# Altium schematic sheet TSK3000A_MOD_Player_Xilinx.SchDoc
size C; DocumentNumber: 1; SheetNumber: 1; SheetTotal: 4
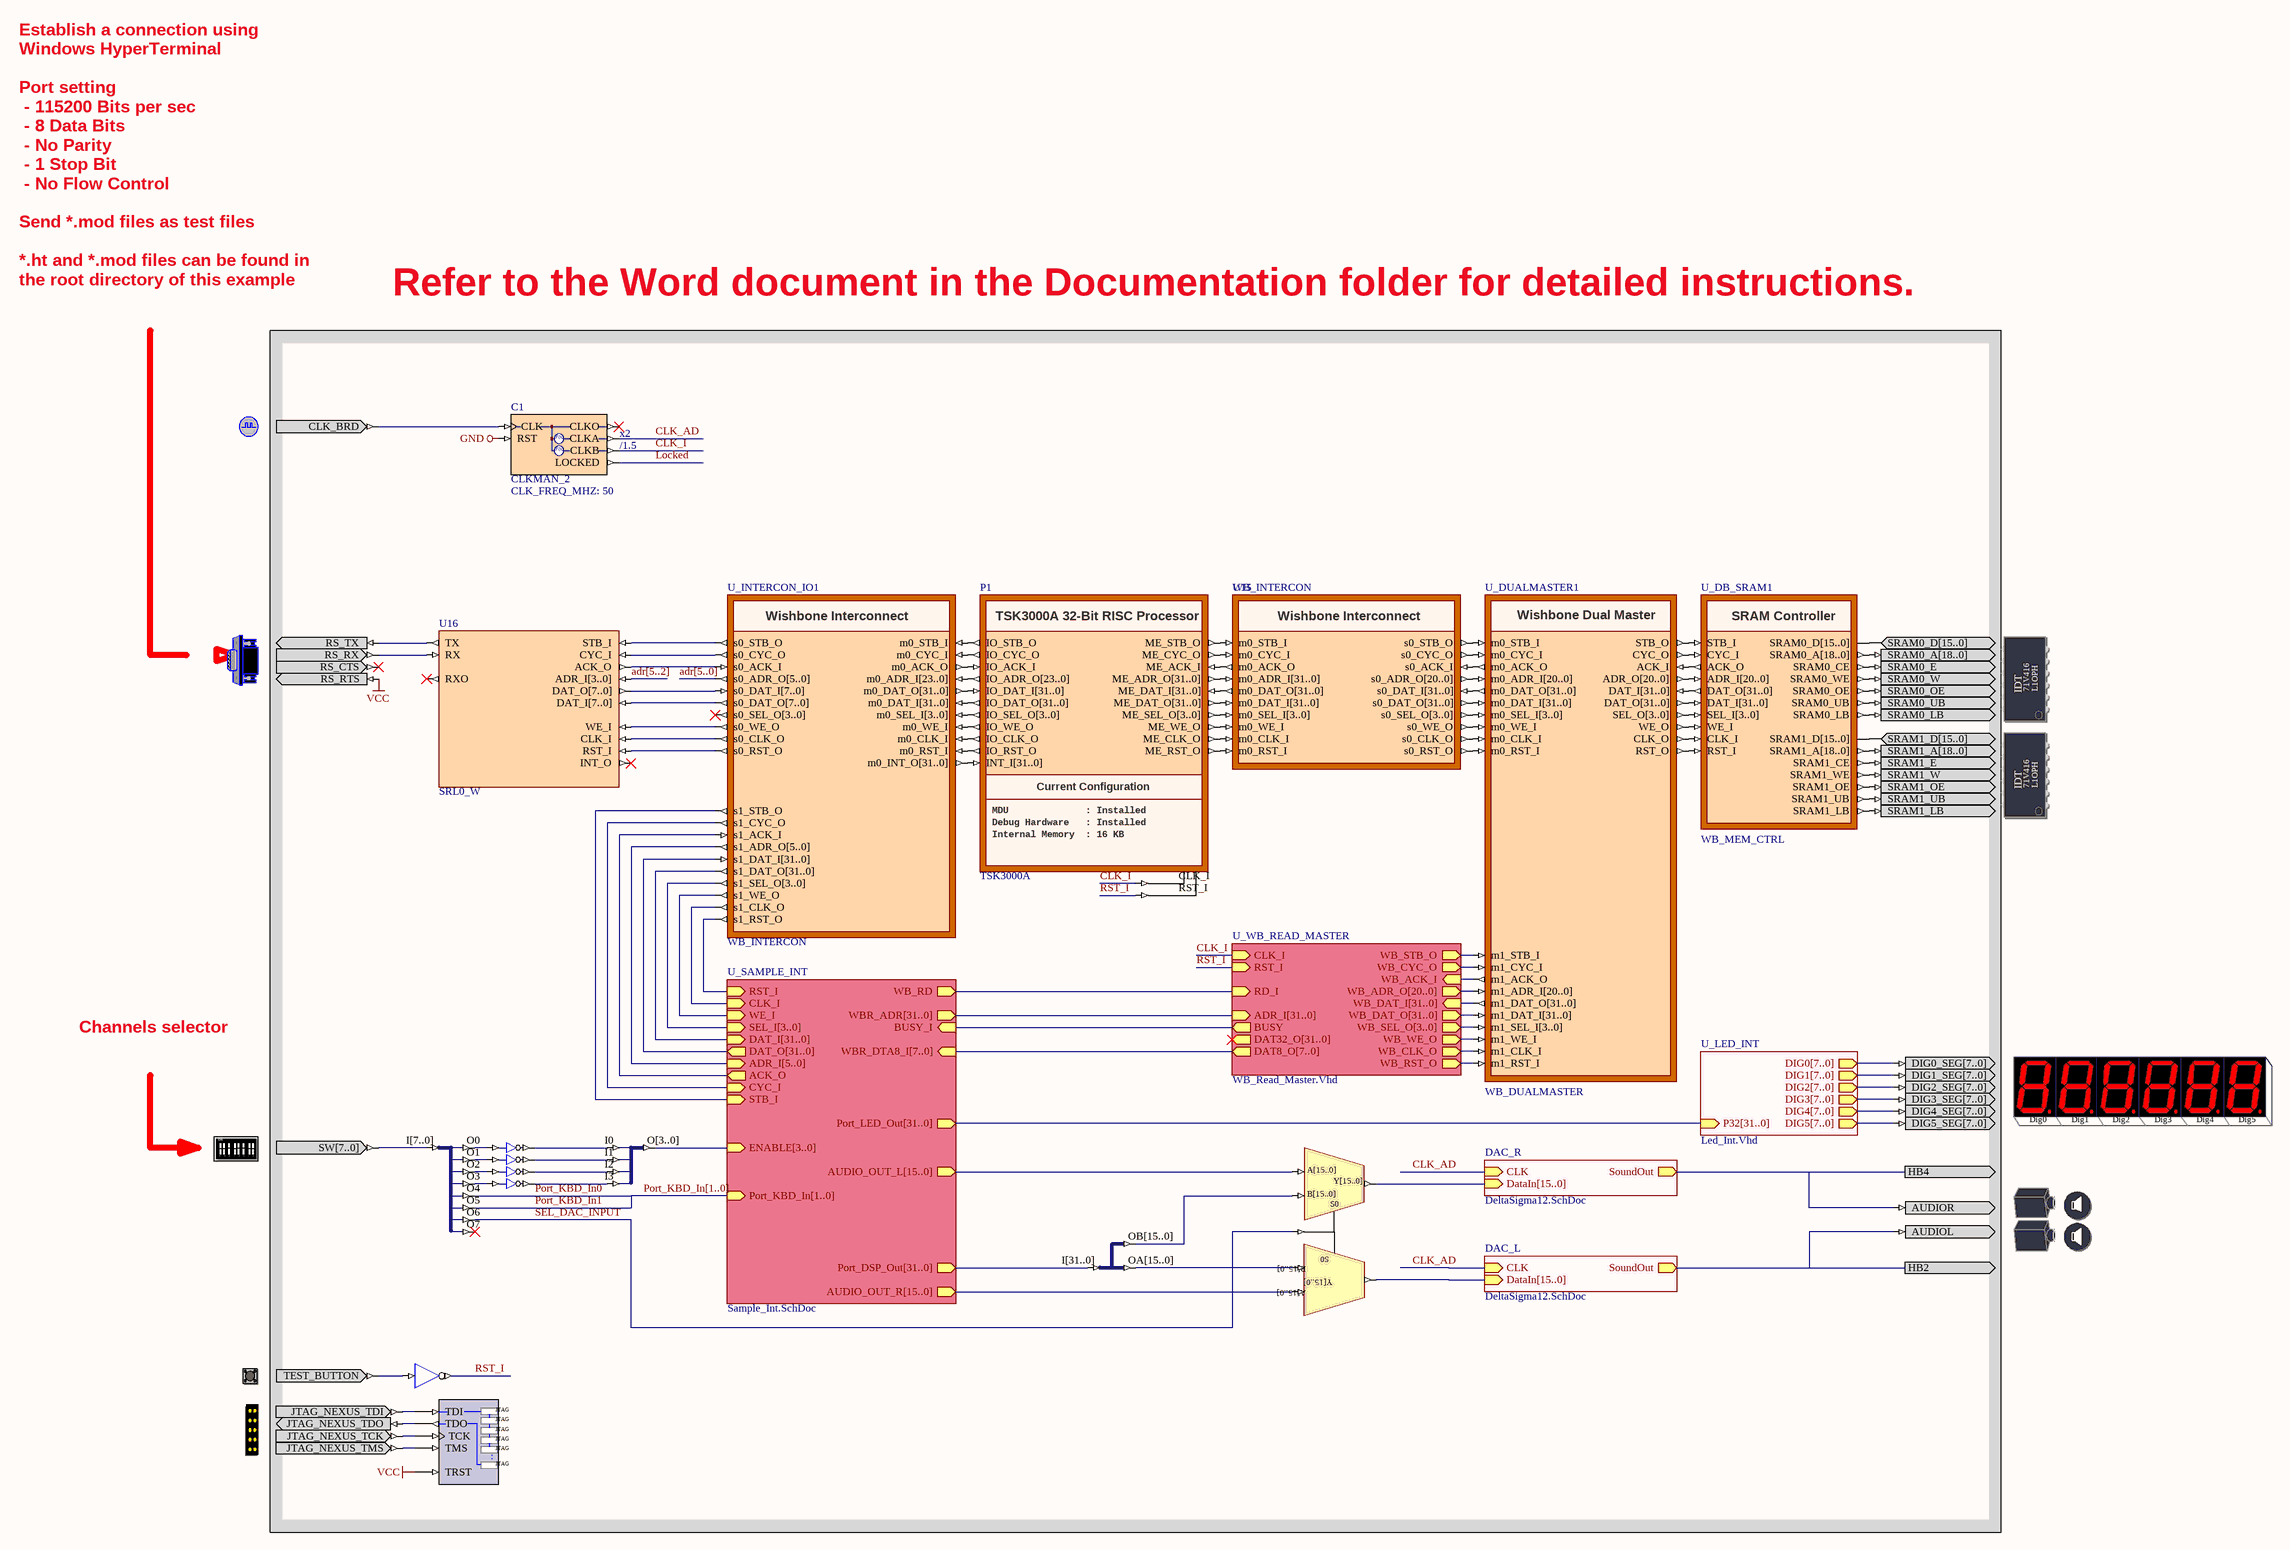
[diagram p0: TSK3000A_MOD_Player_Xilinx.SchDoc]

## Parts
(Parts that share a designator on the sheet are numbered #1, #2 ... from top to bottom, then left to right.)
?#1  CLOCK_BOARD  (value not drawn)
?#2  SRAM_DAUGHTER0  (value not drawn)
?#3  RS232CNTR  (value not drawn)
?#4  SRAM_DAUGHTER1  (value not drawn)
?#5  7SEGX6  (value not drawn)
?#6  DIPSWITCH  (value not drawn)
?#7  STEREO  (value not drawn)
?#8  TEST_BUTTON  (value not drawn)
?#9  NEXUS_JTAG_CONNECTOR  (value not drawn)
C1  CLKMAN_2  CLK_FREQ_MHZ: 50  ClkA_Operation: x2  ClkB_Operation: /1.5
NEXUS_JTAG_PORT  NEXUS_JTAG_PORT  (value not drawn)
P1  TSK3000A
U15  WB_INTERCON
U16  SRL0_W
U17  J8B_8S  (value not drawn)
U18  INV4S  (value not drawn)
U19  J4S_4B  (value not drawn)
U20  M16_B2B1  (value not drawn)
U21  J32B_16B2  (value not drawn)
U22  M16_B2B1  (value not drawn)
U23  INV  (value not drawn)
U_DB_SRAM1  WB_MEM_CTRL
U_DUALMASTER1  WB_DUALMASTER
U_INTERCON_IO1  WB_INTERCON

## Sub-sheets
DAC_L = DeltaSigma12.SchDoc: CLK (in), DataIn[15..0] (in), SoundOut (out)
DAC_R = DeltaSigma12.SchDoc: CLK (in), DataIn[15..0] (in), SoundOut (out)
U_LED_INT = Led_Int.Vhd: DIG0[7..0] (out), DIG1[7..0] (out), DIG2[7..0] (out), DIG3[7..0] (out), DIG4[7..0] (out), DIG5[7..0] (out), P32[31..0] (in)
U_SAMPLE_INT = Sample_Int.SchDoc: CYC_I (in), ACK_O (out), RST_I (in), STB_I (in), ADR_I[5..0] (in), DAT_O[31..0] (out), DAT_I[31..0] (in), SEL_I[3..0] (in), CLK_I (in), WE_I (in), WB_RD (out), WBR_ADR[31..0] (out), AUDIO_OUT_L[15..0] (out), WBR_DTA8_I[7..0] (in), AUDIO_OUT_R[15..0] (out), ENABLE[3..0] (in), BUSY_I (in), Port_KBD_In[1..0] (in), Port_DSP_Out[31..0] (out), Port_LED_Out[31..0] (out)
U_WB_READ_MASTER = WB_Read_Master.Vhd: WB_STB_O (out), WB_CYC_O (out), WB_ACK_I (in), WB_ADR_O[20..0] (out), WB_DAT_I[31..0] (in), WB_DAT_O[31..0] (out), WB_SEL_O[3..0] (out), WB_WE_O (out), WB_CLK_O (out), WB_RST_O (out), CLK_I (in), RST_I (in), RD_I (in), ADR_I[31..0] (in), DAT32_O[31..0] (out), BUSY (out), DAT8_O[7..0] (out)

## Ports
HB2 (out), HB4 (out)

## Nets
GND: C1.RST
VCC: ?#3.RS_RTS NEXUS_JTAG_PORT.TRST
adr[5..0]: U_INTERCON_IO1.s0_ADR_O[5..0]
adr[5..2]: U16.ADR_I[3..0]
CLK_AD: C1.CLKA ; sheet DAC_L/CLK, sheet DAC_R/CLK
CLK_I: C1.CLKB P1.CLK_I ; sheet U_WB_READ_MASTER/CLK_I
HB2: ?#7.AUDIOL ; port HB2, sheet DAC_L/SoundOut
HB4: ?#7.AUDIOR ; port HB4, sheet DAC_R/SoundOut
Locked: C1.LOCKED
Port_KBD_In0: U17.O4
Port_KBD_In1: U17.O5
RST_I: P1.RST_I U23.O ; sheet U_WB_READ_MASTER/RST_I
SEL_DAC_INPUT: U17.O6 U20.S0 U22.S0
Net?#1_CLK_BRD: ?#1.CLK_BRD C1.CLK
Net?#2_SRAM0_A[18..0]: ?#2.SRAM0_A[18..0] U_DB_SRAM1.SRAM0_A[18..0]
Net?#2_SRAM0_D[15..0]: ?#2.SRAM0_D[15..0] U_DB_SRAM1.SRAM0_D[15..0]
Net?#2_SRAM0_E: ?#2.SRAM0_E U_DB_SRAM1.SRAM0_CE
Net?#2_SRAM0_LB: ?#2.SRAM0_LB U_DB_SRAM1.SRAM0_LB
Net?#2_SRAM0_OE: ?#2.SRAM0_OE U_DB_SRAM1.SRAM0_OE
Net?#2_SRAM0_UB: ?#2.SRAM0_UB U_DB_SRAM1.SRAM0_UB
Net?#2_SRAM0_W: ?#2.SRAM0_W U_DB_SRAM1.SRAM0_WE
Net?#3_RS_RX: ?#3.RS_RX U16.RX
Net?#3_RS_TX: ?#3.RS_TX U16.TX
Net?#4_SRAM1_A[18..0]: ?#4.SRAM1_A[18..0] U_DB_SRAM1.SRAM1_A[18..0]
Net?#4_SRAM1_D[15..0]: ?#4.SRAM1_D[15..0] U_DB_SRAM1.SRAM1_D[15..0]
Net?#4_SRAM1_E: ?#4.SRAM1_E U_DB_SRAM1.SRAM1_CE
Net?#4_SRAM1_LB: ?#4.SRAM1_LB U_DB_SRAM1.SRAM1_LB
Net?#4_SRAM1_OE: ?#4.SRAM1_OE U_DB_SRAM1.SRAM1_OE
Net?#4_SRAM1_UB: ?#4.SRAM1_UB U_DB_SRAM1.SRAM1_UB
Net?#4_SRAM1_W: ?#4.SRAM1_W U_DB_SRAM1.SRAM1_WE
Net?#5_DIG0_SEG[7..0]: ?#5.DIG0_SEG[7..0] ; sheet U_LED_INT/DIG0[7..0]
Net?#5_DIG1_SEG[7..0]: ?#5.DIG1_SEG[7..0] ; sheet U_LED_INT/DIG1[7..0]
Net?#5_DIG2_SEG[7..0]: ?#5.DIG2_SEG[7..0] ; sheet U_LED_INT/DIG2[7..0]
Net?#5_DIG3_SEG[7..0]: ?#5.DIG3_SEG[7..0] ; sheet U_LED_INT/DIG3[7..0]
Net?#5_DIG4_SEG[7..0]: ?#5.DIG4_SEG[7..0] ; sheet U_LED_INT/DIG4[7..0]
Net?#5_DIG5_SEG[7..0]: ?#5.DIG5_SEG[7..0] ; sheet U_LED_INT/DIG5[7..0]
Net?#6_SW[7..0]: ?#6.SW[7..0] U17.I[7..0]
Net?#8_TEST_BUTTON: ?#8.TEST_BUTTON U23.I
Net?#9_JTAG_NEXUS_TCK: ?#9.JTAG_NEXUS_TCK NEXUS_JTAG_PORT.TCK
Net?#9_JTAG_NEXUS_TDI: ?#9.JTAG_NEXUS_TDI NEXUS_JTAG_PORT.TDI
Net?#9_JTAG_NEXUS_TDO: ?#9.JTAG_NEXUS_TDO NEXUS_JTAG_PORT.TDO
Net?#9_JTAG_NEXUS_TMS: ?#9.JTAG_NEXUS_TMS NEXUS_JTAG_PORT.TMS
NetP1_INT_I[31..0]: P1.INT_I[31..0] U_INTERCON_IO1.m0_INT_O[31..0]
NetP1_IO_ACK_I: P1.IO_ACK_I U_INTERCON_IO1.m0_ACK_O
NetP1_IO_ADR_O[23..0]: P1.IO_ADR_O[23..0] U_INTERCON_IO1.m0_ADR_I[23..0]
NetP1_IO_CLK_O: P1.IO_CLK_O U_INTERCON_IO1.m0_CLK_I
NetP1_IO_CYC_O: P1.IO_CYC_O U_INTERCON_IO1.m0_CYC_I
NetP1_IO_DAT_I[31..0]: P1.IO_DAT_I[31..0] U_INTERCON_IO1.m0_DAT_O[31..0]
NetP1_IO_DAT_O[31..0]: P1.IO_DAT_O[31..0] U_INTERCON_IO1.m0_DAT_I[31..0]
NetP1_IO_RST_O: P1.IO_RST_O U_INTERCON_IO1.m0_RST_I
NetP1_IO_SEL_O[3..0]: P1.IO_SEL_O[3..0] U_INTERCON_IO1.m0_SEL_I[3..0]
NetP1_IO_STB_O: P1.IO_STB_O U_INTERCON_IO1.m0_STB_I
NetP1_IO_WE_O: P1.IO_WE_O U_INTERCON_IO1.m0_WE_I
NetP1_ME_ACK_I: P1.ME_ACK_I U15.m0_ACK_O
NetP1_ME_ADR_O[31..0]: P1.ME_ADR_O[31..0] U15.m0_ADR_I[31..0]
NetP1_ME_CLK_O: P1.ME_CLK_O U15.m0_CLK_I
NetP1_ME_CYC_O: P1.ME_CYC_O U15.m0_CYC_I
NetP1_ME_DAT_I[31..0]: P1.ME_DAT_I[31..0] U15.m0_DAT_O[31..0]
NetP1_ME_DAT_O[31..0]: P1.ME_DAT_O[31..0] U15.m0_DAT_I[31..0]
NetP1_ME_RST_O: P1.ME_RST_O U15.m0_RST_I
NetP1_ME_SEL_O[3..0]: P1.ME_SEL_O[3..0] U15.m0_SEL_I[3..0]
NetP1_ME_STB_O: P1.ME_STB_O U15.m0_STB_I
NetP1_ME_WE_O: P1.ME_WE_O U15.m0_WE_I
NetU15_s0_ACK_I: U15.s0_ACK_I U_DUALMASTER1.m0_ACK_O
NetU15_s0_ADR_O[20..0]: U15.s0_ADR_O[20..0] U_DUALMASTER1.m0_ADR_I[20..0]
NetU15_s0_CLK_O: U15.s0_CLK_O U_DUALMASTER1.m0_CLK_I
NetU15_s0_CYC_O: U15.s0_CYC_O U_DUALMASTER1.m0_CYC_I
NetU15_s0_DAT_I[31..0]: U15.s0_DAT_I[31..0] U_DUALMASTER1.m0_DAT_O[31..0]
NetU15_s0_DAT_O[31..0]: U15.s0_DAT_O[31..0] U_DUALMASTER1.m0_DAT_I[31..0]
NetU15_s0_RST_O: U15.s0_RST_O U_DUALMASTER1.m0_RST_I
NetU15_s0_SEL_O[3..0]: U15.s0_SEL_O[3..0] U_DUALMASTER1.m0_SEL_I[3..0]
NetU15_s0_STB_O: U15.s0_STB_O U_DUALMASTER1.m0_STB_I
NetU15_s0_WE_O: U15.s0_WE_O U_DUALMASTER1.m0_WE_I
NetU16_ACK_O: U16.ACK_O U_INTERCON_IO1.s0_ACK_I
NetU16_CLK_I: U16.CLK_I U_INTERCON_IO1.s0_CLK_O
NetU16_CYC_I: U16.CYC_I U_INTERCON_IO1.s0_CYC_O
NetU16_DAT_I[7..0]: U16.DAT_I[7..0] U_INTERCON_IO1.s0_DAT_O[7..0]
NetU16_DAT_O[7..0]: U16.DAT_O[7..0] U_INTERCON_IO1.s0_DAT_I[7..0]
NetU16_RST_I: U16.RST_I U_INTERCON_IO1.s0_RST_O
NetU16_STB_I: U16.STB_I U_INTERCON_IO1.s0_STB_O
NetU16_WE_I: U16.WE_I U_INTERCON_IO1.s0_WE_O
NetU17_O0: U17.O0 U18.I0
NetU17_O1: U17.O1 U18.I1
NetU17_O2: U17.O2 U18.I2
NetU17_O3: U17.O3 U18.I3
NetU18_O0: U18.O0 U19.I0
NetU18_O1: U18.O1 U19.I1
NetU18_O2: U18.O2 U19.I2
NetU18_O3: U18.O3 U19.I3
NetU19_O[3..0]: U19.O[3..0] ; sheet U_SAMPLE_INT/ENABLE[3..0]
NetU20_A[15..0]: U20.A[15..0] ; sheet U_SAMPLE_INT/AUDIO_OUT_L[15..0]
NetU20_B[15..0]: U20.B[15..0] U21.OB[15..0]
NetU20_Y[15..0]: U20.Y[15..0] ; sheet DAC_R/DataIn[15..0]
NetU21_I[31..0]: U21.I[31..0] ; sheet U_SAMPLE_INT/Port_DSP_Out[31..0]
NetU21_OA[15..0]: U21.OA[15..0] U22.B[15..0]
NetU22_A[15..0]: U22.A[15..0] ; sheet U_SAMPLE_INT/AUDIO_OUT_R[15..0]
NetU22_Y[15..0]: U22.Y[15..0] ; sheet DAC_L/DataIn[15..0]
NetU_DB_SRAM1_ACK_O: U_DB_SRAM1.ACK_O U_DUALMASTER1.ACK_I
NetU_DB_SRAM1_ADR_I[20..0]: U_DB_SRAM1.ADR_I[20..0] U_DUALMASTER1.ADR_O[20..0]
NetU_DB_SRAM1_CLK_I: U_DB_SRAM1.CLK_I U_DUALMASTER1.CLK_O
NetU_DB_SRAM1_CYC_I: U_DB_SRAM1.CYC_I U_DUALMASTER1.CYC_O
NetU_DB_SRAM1_DAT_I[31..0]: U_DB_SRAM1.DAT_I[31..0] U_DUALMASTER1.DAT_O[31..0]
NetU_DB_SRAM1_DAT_O[31..0]: U_DB_SRAM1.DAT_O[31..0] U_DUALMASTER1.DAT_I[31..0]
NetU_DB_SRAM1_RST_I: U_DB_SRAM1.RST_I U_DUALMASTER1.RST_O
NetU_DB_SRAM1_SEL_I[3..0]: U_DB_SRAM1.SEL_I[3..0] U_DUALMASTER1.SEL_O[3..0]
NetU_DB_SRAM1_STB_I: U_DB_SRAM1.STB_I U_DUALMASTER1.STB_O
NetU_DB_SRAM1_WE_I: U_DB_SRAM1.WE_I U_DUALMASTER1.WE_O
NetU_DUALMASTER1_m1_ACK_O: U_DUALMASTER1.m1_ACK_O ; sheet U_WB_READ_MASTER/WB_ACK_I
NetU_DUALMASTER1_m1_ADR_I[20..0]: U_DUALMASTER1.m1_ADR_I[20..0] ; sheet U_WB_READ_MASTER/WB_ADR_O[20..0]
NetU_DUALMASTER1_m1_CLK_I: U_DUALMASTER1.m1_CLK_I ; sheet U_WB_READ_MASTER/WB_CLK_O
NetU_DUALMASTER1_m1_CYC_I: U_DUALMASTER1.m1_CYC_I ; sheet U_WB_READ_MASTER/WB_CYC_O
NetU_DUALMASTER1_m1_DAT_I[31..0]: U_DUALMASTER1.m1_DAT_I[31..0] ; sheet U_WB_READ_MASTER/WB_DAT_O[31..0]
NetU_DUALMASTER1_m1_DAT_O[31..0]: U_DUALMASTER1.m1_DAT_O[31..0] ; sheet U_WB_READ_MASTER/WB_DAT_I[31..0]
NetU_DUALMASTER1_m1_RST_I: U_DUALMASTER1.m1_RST_I ; sheet U_WB_READ_MASTER/WB_RST_O
NetU_DUALMASTER1_m1_SEL_I[3..0]: U_DUALMASTER1.m1_SEL_I[3..0] ; sheet U_WB_READ_MASTER/WB_SEL_O[3..0]
NetU_DUALMASTER1_m1_STB_I: U_DUALMASTER1.m1_STB_I ; sheet U_WB_READ_MASTER/WB_STB_O
NetU_DUALMASTER1_m1_WE_I: U_DUALMASTER1.m1_WE_I ; sheet U_WB_READ_MASTER/WB_WE_O
NetU_INTERCON_IO1_s1_ACK_I: U_INTERCON_IO1.s1_ACK_I ; sheet U_SAMPLE_INT/ACK_O
NetU_INTERCON_IO1_s1_ADR_O[5..0]: U_INTERCON_IO1.s1_ADR_O[5..0] ; sheet U_SAMPLE_INT/ADR_I[5..0]
NetU_INTERCON_IO1_s1_CLK_O: U_INTERCON_IO1.s1_CLK_O ; sheet U_SAMPLE_INT/CLK_I
NetU_INTERCON_IO1_s1_CYC_O: U_INTERCON_IO1.s1_CYC_O ; sheet U_SAMPLE_INT/CYC_I
NetU_INTERCON_IO1_s1_DAT_I[31..0]: U_INTERCON_IO1.s1_DAT_I[31..0] ; sheet U_SAMPLE_INT/DAT_O[31..0]
NetU_INTERCON_IO1_s1_DAT_O[31..0]: U_INTERCON_IO1.s1_DAT_O[31..0] ; sheet U_SAMPLE_INT/DAT_I[31..0]
NetU_INTERCON_IO1_s1_RST_O: U_INTERCON_IO1.s1_RST_O ; sheet U_SAMPLE_INT/RST_I
NetU_INTERCON_IO1_s1_SEL_O[3..0]: U_INTERCON_IO1.s1_SEL_O[3..0] ; sheet U_SAMPLE_INT/SEL_I[3..0]
NetU_INTERCON_IO1_s1_STB_O: U_INTERCON_IO1.s1_STB_O ; sheet U_SAMPLE_INT/STB_I
NetU_INTERCON_IO1_s1_WE_O: U_INTERCON_IO1.s1_WE_O ; sheet U_SAMPLE_INT/WE_I
(unnamed): sheet U_WB_READ_MASTER/RD_I, sheet U_SAMPLE_INT/WB_RD
(unnamed): sheet U_WB_READ_MASTER/BUSY, sheet U_SAMPLE_INT/BUSY_I

Not connected (* = marked no-connect by the designer): ?#3 RS_CTS*; C1 CLKO*; U16 INT_O* RXO*; U17 O7*; U_INTERCON_IO1 s0_SEL_O[3..0]*

## Buses and harness runs
bus adr[5..0]
bus adr[5..2]
bus Port_KBD_In[1..0] = sheet U_SAMPLE_INT/Port_KBD_In[1..0]
bus sheet U_LED_INT/P32[31..0] = sheet U_SAMPLE_INT/Port_LED_Out[31..0]
bus sheet U_SAMPLE_INT/WBR_ADR[31..0] = sheet U_WB_READ_MASTER/ADR_I[31..0]
bus sheet U_SAMPLE_INT/WBR_DTA8_I[7..0] = sheet U_WB_READ_MASTER/DAT8_O[7..0]

## Notes on the sheet
- Establish a connection using Windows HyperTerminal
  Port setting
  - 115200 Bits per sec
  - 8 Data Bits
  - No Parity
  - 1 Stop Bit
  - No Flow Control
  Send *.mod files as test files
  *.ht and *.mod files can be found in the root directory of this example
- Refer to the Word document in the Documentation folder for detailed instructions.
- Channels selector
- Title
- Size:
- Date:
- File:
- C
- Number:
- Time:
- Revision:
- Sheet
- of
- (in symbol 7SEGX6) Dig0; Dig1; Dig2; Dig3; Dig4; Dig5
- (in symbol CLKMAN_2) F(x)
- (in symbol DIPSWITCH) ON; 1; 2; 3; 4; 5; 6; 7; 8
- (in symbol NEXUS_JTAG_PORT) JTAG; .
- (in symbol SRAM_DAUGHTER0) IDT; 71V416; L1OPH
- (in symbol SRAM_DAUGHTER1) IDT; 71V416; L1OPH
- (in symbol TSK3000A) TSK3000A 32-Bit RISC Processor; Current Configuration; MDU              : Installed; Debug Hardware   : Installed; Internal Memory  : 16 KB
- (in symbol WB_DUALMASTER) Wishbone Dual Master
- (in symbol WB_INTERCON) Wishbone Interconnect
- (in symbol WB_MEM_CTRL) SRAM Controller

## Library data of the parts
?#1 = CLOCK_BOARD: Global System Clock Supply; PortComponent: True; Published: 19-Nov-2003; Publisher: Altium Limited; HelpURL: TR0104 LiveDesign Evaluation Board Technical Reference Manual.pdf#page=19
?#2 = SRAM_DAUGHTER0: SRAM - 0 Module - Daughterboard; PortComponent: True; Published: 13-May-2004; Publisher: Altium Limited
?#3 = RS232CNTR: DCE Serial Port Connector; PortComponent: True; Published: 19-Nov-2003; Publisher: Altium Limited; HelpURL: TR0104 LiveDesign Evaluation Board Technical Reference Manual.pdf#page=20
?#4 = SRAM_DAUGHTER1: SRAM - 1 Module - Daughterboard; PortComponent: True; Published: 13-May-2004; Publisher: Altium Limited
?#5 = 7SEGX6: 6 x 7 Segment display module; PortComponent: True; Publisher: Altium Limited; Published: 9-Sept-2004; HelpURL: TR0104 LiveDesign Evaluation Board Technical Reference Manual.pdf#page=22
?#6 = DIPSWITCH: 8-Way Dip Switch; PortComponent: True; Published: 19-Nov-2003; Publisher: Altium Limited; HelpURL: TR0104 LiveDesign Evaluation Board Technical Reference Manual.pdf#page=23
?#7 = STEREO: Sound interface; PortComponent: True; Published: 19-Nov-2003; Publisher: Altium Limited; HelpURL: TR0104 LiveDesign Evaluation Board Technical Reference Manual.pdf#page=22
?#8 = TEST_BUTTON: Test Button; PortComponent: True; Published: 19-Nov-2003; Publisher: Altium Limited; HelpURL: TR0104 LiveDesign Evaluation Board Technical Reference Manual.pdf#page=24
?#9 = NEXUS_JTAG_CONNECTOR: JTAG Port; PortComponent: True; Published: 19-Nov-2003; Publisher: Altium Limited
C1 = CLKMAN_2: Dual Operational Output Clock Manager; Clk_Count: 2; Published: 5-Jul-2004; Publisher: Altium Limited; LastRevisionNo: 1.00.00; Nexus_Core: ClockManager; HelpURL: CR0118 FPGA Generic Library Guide.pdf#page=149; ComponentLink1URL: CR0128 FPGA Clock Manager Resource Usage.pdf#page=3; ComponentLink1Description: Core &Resource Usage; FunctionalClass: Clock Manager; PortSize: 2
NEXUS_JTAG_PORT = NEXUS_JTAG_PORT: Soft Nexus-Chain Connector; NEXUS_JTAG_CONNECTOR: True; Published: 18-Dec-2003; Publisher: Altium Limited
P1 = TSK3000A: TSK3000A OCD Microprocessor; ChildModel1: TSK3000A_MCU; Nexus_JTAG_Device: True; Nexus_Core: Processor_OCDS; Nexus_JTAG_Order: 0; ChildModel2: TSK3000A_MDU; ChildModel3: TSK3000A_OCDS; ChildModel4: TSK3000A_Shift_Barrel; ChildModel5: TSK3000A_Shift_Sequential; ChildModel6: Mult_32x32; ConfigurationParameters: {}Option_Processor[0]{}Option_Memory[4]{}Option_MDU[0]{}Option_OCDS[0]{}Option_Shifter[0]{}Option_InterruptCount[32]{}Option_DebugWhenReset[0]{}; ChildModel7: m33x33; ConfiguratorName: FPGA_MCU32; ProgramLogicalTopAddress: 0; ComponentLink1Description: Core &Resource Usage; ComponentLink1URL: CR0140 FPGA Processor Resource Usage.pdf#page=16; ComponentLink2Description: Embedded &Tools Guide; ComponentLink2URL: GU0111 Using the TSK3000 Embedded Tools.pdf; ComponentLink3Description: Embedded T&echnical References; ComponentLink3URL: TR0109 TSK3000 Embedded Tools Reference.pdf; HelpURL: CR0121 TSK3000A 32 bit RISC Processor.pdf#page=6; LastRevisionNo: 1.00.00; Published: 17-Nov-2004; Publisher: Altium Limited
U15 = WB_INTERCON: Configurable Wishbone Interconnect; ConfigurationParameters: {}UnusedInterrupts[2]{}MasterAddressBits[0]{}Name0[RAM]{}Kind0[2]{}SpaceAfter0[12]{}Address_Base0[16777216]{}Address_UsedRange0[524288]{}Address_Bits0[21]{}Address_Mode0[1]{}Address_DecodeWidth0[8]{}DataWidth0[0]{}UsedInterrupts0[]; ComponentLink1Description: Core &Resource Usage; ComponentLink1URL: CR0139 FPGA Peripheral Resource Usage.pdf#page=51; HelpURL: CR0150 WB_INTERCON Configurable Wishbone Interconnect.pdf#page=2; LastRevisionNo: 1.00.00; Published: 9-Dec-2004; Publisher: Altium Limited; ConfiguratorName: WB_INTERCON
U16 = SRL0_W: Serial 0 Wishbone; Published: 9-Dec-2004; Publisher: Altium Limited; ComponentLink1Description: Core &Resource Usage; ComponentLink1URL: CR0139 FPGA Peripheral Resource Usage.pdf#page=40; HelpURL: CR0111 SRL0 Serial Port Unit.pdf#page=2; LastRevisionNo: 1.00.00
U17 = J8B_8S: 8-Bit input bus to 8 single pin outputs; ArchiveName: GENERIC; VHDLIB_SIM: GENERIC_LIB; FunctionalClass: Bus Joiner; PortSize: 8; Published: 29-Jan-2004; Publisher: Altium Limited; ComponentLink1Description: Core &Resource Usage; ComponentLink1URL: CR0126 FPGA Bus Joiner Resource Usage.pdf#page=27; HelpURL: CR0118 FPGA Generic Library Guide.pdf#page=303; LastRevisionNo: 1.00.00
U18 = INV4S: 4-Bit Inverter, Single Pin Version; XilinxEquivalent: INV4; FunctionalClass: Logic Primitive; SubClass: INV; PortSize: 4; ArchiveName: GENERIC; VHDLIB_SIM: GENERIC_LIB; Published: 29-Jan-2004; Publisher: Altium Limited; LastRevisionNo: 1.00.00; HelpURL: CR0118 FPGA Generic Library Guide.pdf#page=290; ComponentLink1URL: CR0136 FPGA Logic Primitive Resource Usage.pdf#page=67; ComponentLink1Description: Core &Resource Usage; PortStyle: Single Pin Version
U19 = J4S_4B: 4 Single pin inputs to single 4-Bit output bus; FunctionalClass: Bus Joiner; PortSize: 4; ArchiveName: GENERIC; VHDLIB_SIM: GENERIC_LIB; Published: 29-Jan-2004; Publisher: Altium Limited; LastRevisionNo: 1.00.00; HelpURL: CR0118 FPGA Generic Library Guide.pdf#page=305; ComponentLink1URL: CR0126 FPGA Bus Joiner Resource Usage.pdf#page=12; ComponentLink1Description: Core &Resource Usage
U20 U22 = M16_B2B1: 2x16-Bit Bus to 1x16-Bit Bus Multiplexer; SubClass: BnB1; PortSize: 16; ArchiveName: GENERIC; VHDLIB_SIM: GENERIC_LIB; Published: 29-Jan-2004; Publisher: Altium Limited; LastRevisionNo: 1.00.00; HelpURL: CR0118 FPGA Generic Library Guide.pdf#page=358; ComponentLink1URL: CR0137 FPGA Multiplexer Resource Usage.pdf#page=418; ComponentLink1Description: Core &Resource Usage; FunctionalClass: Multiplexer
U21 = J32B_16B2: 1 x 32-bit input bus to 2 x 16-Bit output bus; FunctionalClass: Bus Joiner; PortSize: 32; ArchiveName: GENERIC; VHDLIB_SIM: GENERIC_LIB; Published: 29-Jan-2004; Publisher: Altium Limited; LastRevisionNo: 1.00.00; HelpURL: CR0118 FPGA Generic Library Guide.pdf#page=297; ComponentLink1URL: CR0126 FPGA Bus Joiner Resource Usage.pdf#page=51; ComponentLink1Description: Core &Resource Usage
U23 = INV: Inverter; ArchiveName: GENERIC; FunctionalClass: Logic Primitive; VHDLIB_SIM: GENERIC_LIB; Published: 29-Jan-2004; Publisher: Altium Limited; ComponentLink1Description: Core &Resource Usage; ComponentLink1URL: CR0136 FPGA Logic Primitive Resource Usage.pdf#page=61; HelpURL: CR0118 FPGA Generic Library Guide.pdf#page=290; LastRevisionNo: 1.00.00; SubClass: INV; XilinxEquivalent: INV
U_DB_SRAM1 = WB_MEM_CTRL: Configurable Memory Controller; ConfigurationParameters: {}Option_MemoryType[Asynchronous SRAM]{}Option_MemorySize[2 Mb (512K x 32-bit)]{}Option_Layout[2 x 16-bit Wide Devices]{}Option_Read[2]{}Option_WriteSetup[1]{}Option_WritePulse[1]{}Option_WriteHold[1]{}; ComponentLink1Description: Core &Resource Usage; ComponentLink1URL: CR0139 FPGA Peripheral Resource Usage.pdf#page=58; HelpURL: CR0152 WB_MEM_CTRL Configurable Wishbone Memory Controller.pdf#page=2; LastRevisionNo: 1.00.00; Published: 9-Dec-2004; Publisher: Altium Limited; ConfiguratorName: WB_MEM_CTRL
U_DUALMASTER1 = WB_DUALMASTER: Configurable Wishbone Dual Master; ConfigurationParameters: {}DataWidth[0]{}AddressWidth[21]{}SpaceAfter[17]{}DualType[0]{}PriorityDevice[0]; ComponentLink1Description: Core &Resource Usage; ComponentLink1URL: CR0139 FPGA Peripheral Resource Usage.pdf#page=45; HelpURL: CR0151 WB_DUALMASTER Configurable Wishbone Dual Master.pdf#page=2; LastRevisionNo: 1.00.00; Published: 9-Dec-2004; Publisher: Altium Limited; ConfiguratorName: WB_DUALMASTER
U_INTERCON_IO1 = WB_INTERCON: Configurable Wishbone Interconnect; ConfigurationParameters: {}UnusedInterrupts[1]{}MasterAddressBits[1]{}Name0[Serial]{}Kind0[0]{}SpaceAfter0[4]{}Address_Base0[256]{}Address_UsedRange0[4]{}Address_Bits0[6]{}Address_Mode0[0]{}Address_DecodeWidth0[16]{}DataWidth0[2]{}UsedInterrupts0[]{}Name1[Audio]{}Kind1[0]{}SpaceAfter1[4]{}Address_Base1[0]{}Address_UsedRange1[1]{}Address_Bits1[6]{}Address_Mode1[1]{}Address_DecodeWidth1[16]{}DataWidth1[0]{}UsedInterrupts1[]; ComponentLink1Description: Core &Resource Usage; ComponentLink1URL: CR0139 FPGA Peripheral Resource Usage.pdf#page=51; HelpURL: CR0150 WB_INTERCON Configurable Wishbone Interconnect.pdf#page=2; LastRevisionNo: 1.00.00; Published: 9-Dec-2004; Publisher: Altium Limited; ConfiguratorName: WB_INTERCON